# EAGLE design BR216_MKL_3075_21MTC_J2_010_01_07 (EAGLE 5.10)
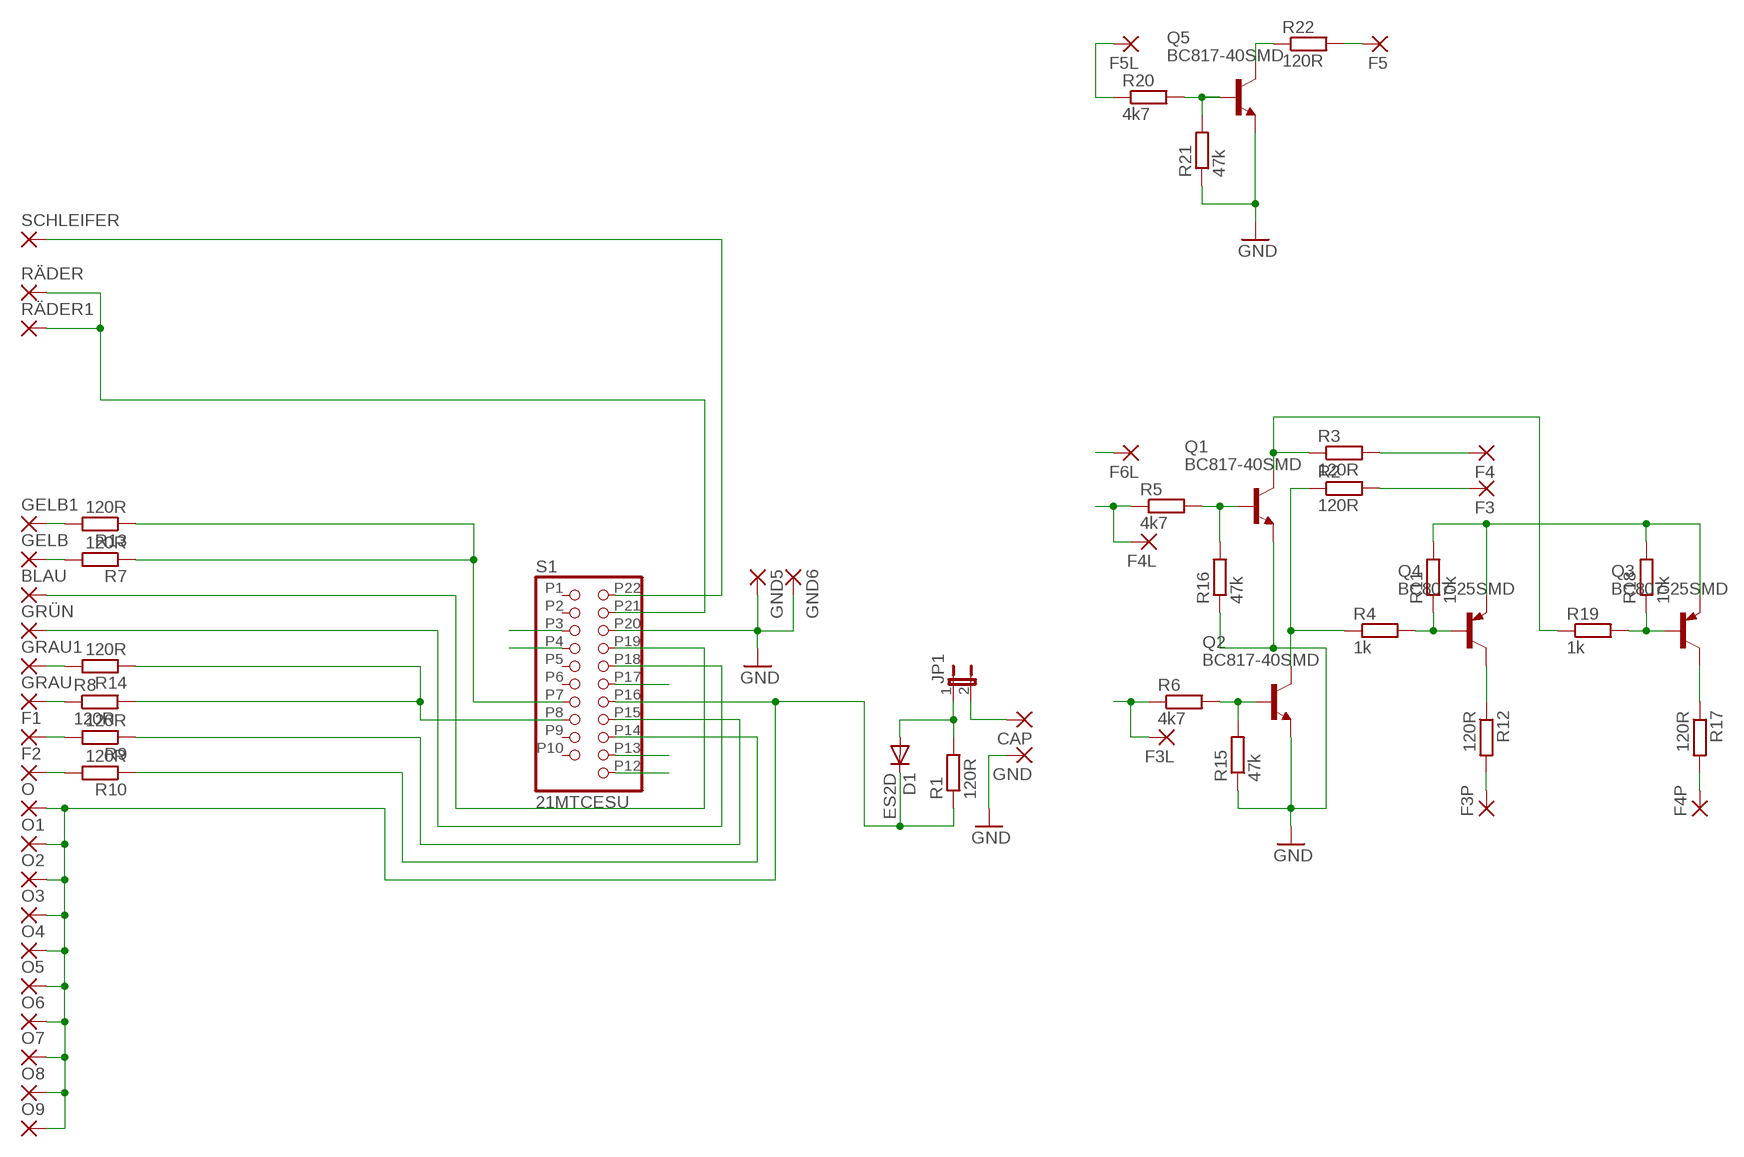
[diagram p0: schematic, sheet 1]

## Parts
BLAU  SMD2  [SMD1,27-2,54]
CAP  SMD2  [SMD1,27-2,54]
D1  ES2D  [SMB]
F1  SMD2  [SMD1,27-2,54]
F2  SMD2  [SMD1,27-2,54]
F3  SMD2  [SMD1,27-2,54]
F3L  SMD2  [SMD1,27-2,54]
F3P  SMD2  [SMD1,27-2,54]
F4  SMD2  [SMD1,27-2,54]
F4L  SMD2  [SMD1,27-2,54]
F4P  SMD2  [SMD1,27-2,54]
F5  SMD2  [SMD1,27-2,54]
F5L  SMD2  [SMD1,27-2,54]
F6L  SMD2  [SMD1,27-2,54]
GELB  SMD2  [SMD1,27-2,54]
GELB1  SMD2  [SMD1,27-2,54]
GND  SMD2  [SMD1,27-2,54]
GND5  SMD2  [SMD1,27-2,54]
GND6  SMD2  [SMD1,27-2,54]
GRAU  SMD2  [SMD1,27-2,54]
GRAU1  SMD2  [SMD1,27-2,54]
GRÜN  SMD2  [SMD1,27-2,54]
JP1  JP1E2,00  [JP1_2]
O  SMD2  [SMD1,27-2,54]
O1  SMD2  [SMD1,27-2,54]
O2  SMD2  [SMD1,27-2,54]
O3  SMD2  [SMD1,27-2,54]
O4  SMD2  [SMD1,27-2,54]
O5  SMD2  [SMD1,27-2,54]
O6  SMD2  [SMD1,27-2,54]
O7  SMD2  [SMD1,27-2,54]
O8  SMD2  [SMD1,27-2,54]
O9  SMD2  [SMD1,27-2,54]
Q1  BC817-40SMD  [SOT23-BEC]
Q2  BC817-40SMD  [SOT23-BEC]
Q3  BC807-25SMD  [SOT23-BEC]
Q4  BC807-25SMD  [SOT23-BEC]
Q5  BC817-40SMD  [SOT23-BEC]
R1  120R  R-EU_R0603S  [R0603S]
R2  120R  R-EU_R0603S  [R0603S]
R3  120R  R-EU_R0603S  [R0603S]
R4  1k  R-EU_R0603  [R0603]
R5  4k7  R-EU_R0603  [R0603]
R6  4k7  R-EU_R0603  [R0603]
R7  120R  R-EU_R0603S  [R0603S]
R8  120R  R-EU_R0603S  [R0603S]
R9  120R  R-EU_R0603S  [R0603S]
R10  120R  R-EU_R0603S  [R0603S]
R11  10k  R-EU_R0603  [R0603]
R12  120R  R-EU_R0603S  [R0603S]
R13  120R  R-EU_R0603S  [R0603S]
R14  120R  R-EU_R0603S  [R0603S]
R15  47k  R-EU_R0603  [R0603]
R16  47k  R-EU_R0603  [R0603]
R17  120R  R-EU_R0603S  [R0603S]
R18  10k  R-EU_R0603  [R0603]
R19  1k  R-EU_R0603  [R0603]
R20  4k7  R-EU_R0603  [R0603]
R21  47k  R-EU_R0603  [R0603]
R22  120R  R-EU_R0603S  [R0603S]
RÄDER  SMD2  [SMD1,27-2,54]
RÄDER1  SMD2  [SMD1,27-2,54]
S1  21MTCESU  [21MTC_SMD_ESU]
SCHLEIFER  SMD2  [SMD1,27-2,54]

## Nets
BLAU: BLAU.1(P) S1.P19
CAP: D1.A JP1.1 R1.2
F1: R9.1 S1.P15
F2: R10.1 S1.P14
F3: F3L.1(P) R6.1 S1.P13
F4: F4L.1(P) R5.1 S1.P4
F5: F5L.1(P) R20.1 S1.P17
F6: F6L.1(P) S1.P3
GELB: R7.1 R13.1 S1.P7
GND: GND5.1(P) GND6.1(P) GND.1(P) Q1.E Q2.E Q5.E R15.1 R16.1 R21.1 S1.P20
GRAU: R8.2 R14.1 S1.P8
GRÜN: GRÜN.1(P) S1.P18
N$1: CAP.1(P) JP1.2
N$2: F3.1(P) R2.2
N$3: F1.1(P) R9.2
N$4: F4.1(P) R3.2
N$5: Q2.C R2.1 R4.1
N$6: Q1.C R3.1 R19.1
N$7: Q1.B R5.2 R16.2
N$8: Q2.B R6.2 R15.2
N$9: GELB.1(P) R7.2
N$10: GRAU.1(P) R8.1
N$11: F2.1(P) R10.2
N$12: Q4.B R4.2 R11.1
N$13: F4P.1(P) R17.2
N$14: Q4.C R12.1
N$15: F3P.1(P) R12.2
N$16: GRAU1.1(P) R14.2
N$17: GELB1.1(P) R13.2
N$18: Q3.C R17.1
N$19: Q3.B R18.1 R19.2
N$20: Q5.B R20.2 R21.2
N$21: F5.1(P) R22.2
N$22: Q5.C R22.1
ORANGE: D1.C O1.1(P) O2.1(P) O3.1(P) O4.1(P) O5.1(P) O6.1(P) O7.1(P) O8.1(P) O9.1(P) O.1(P) Q3.E Q4.E R1.1 R11.2 R18.2 S1.P16
RÄDER: RÄDER1.1(P) RÄDER.1(P) S1.P21
SCHLEIFER: S1.P22 SCHLEIFER.1(P)
VCC: S1.P12
Unconnected: S1.P1 S1.P2 S1.P5 S1.P6 S1.P9 S1.P10

## Library data of the parts
BLAU CAP F1-F3 F3L F3P F4 F4L F4P F5 F5L F6L GELB GELB1 GND GND5 GND6 GRAU GRAU1 GRÜN O O1-O9 RÄDER RÄDER1 SCHLEIFER = wirepad:SMD2: SMD PAD
D1 = diode:ES2D: DIODE super fast rectifier, 2 A
JP1 = jumper:JP1E: JUMPER
Q1 Q2 Q5 = transistor-npn:BC817*: NPN Transistor
Q3 Q4 = transistor-pnp:BC807*: PNP Transistror
R1-R22 = rcl:R-EU_: RESISTOR, European symbol
S1 = pinhead:21MTC

## Board
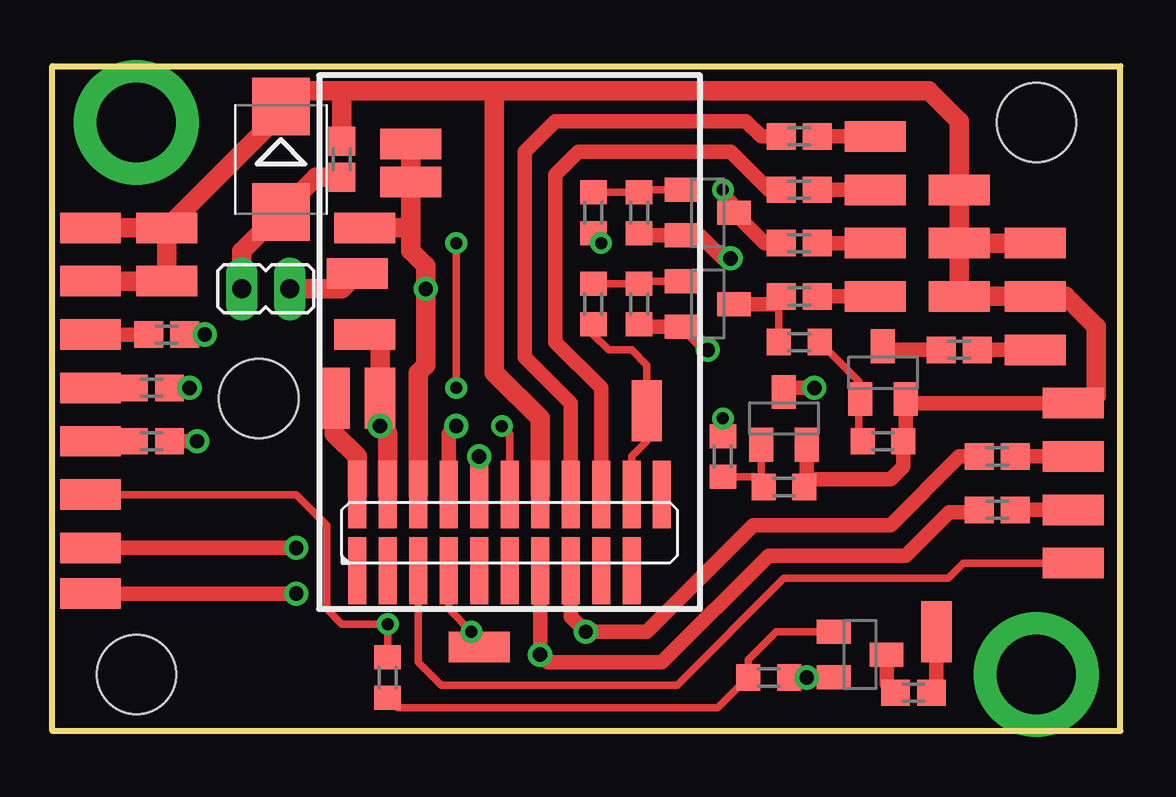
[diagram p1: board, top side]
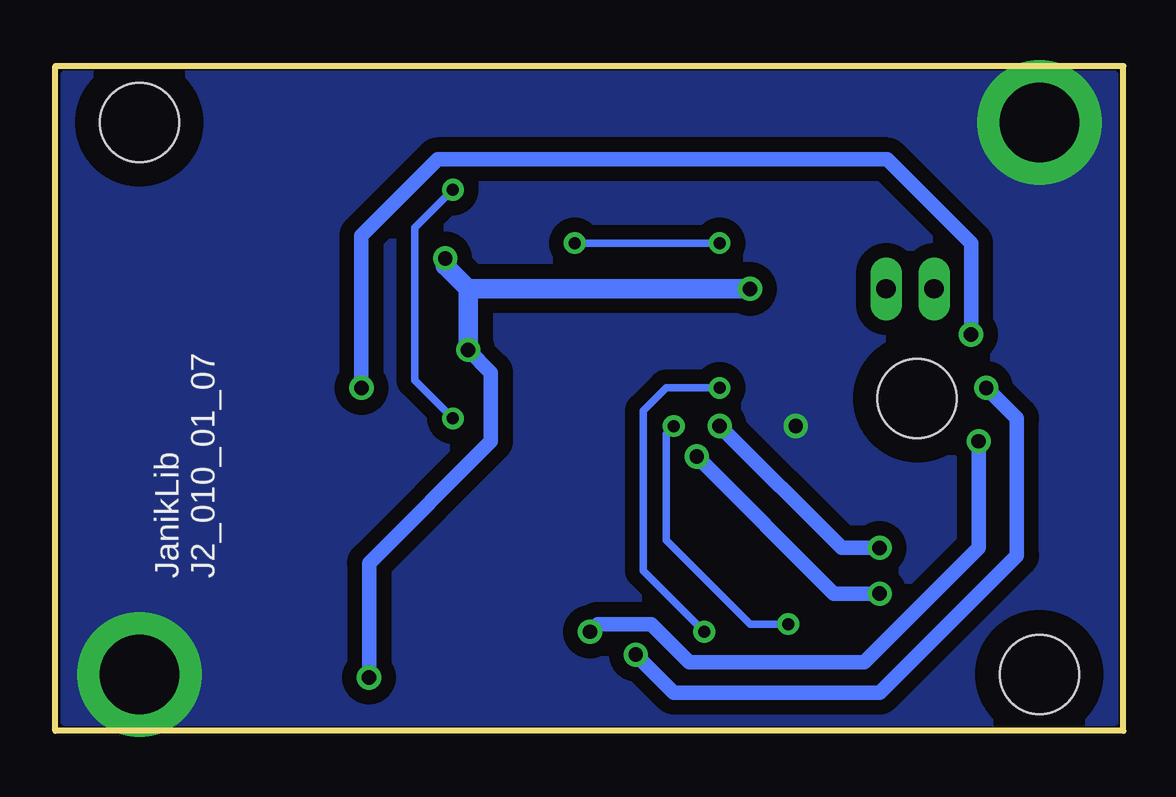
[diagram p2: board, bottom side, seen from below]

No outline drawn. Coordinates in mm, seen from the top.
Copper layers (1*16): Top 0.035mm / dielectric 1.5mm / Bottom 0.035mm
Design rules "default *": minimum track width 10mil, minimum drill 0.6mm, track to track 8mil, track to pad 8mil, pad to pad 8mil, via to via 8mil, smd to smd 8mil, copper to edge 40mil, drill to drill 8mil, minimum pad ring 10mil, minimum via ring 8mil, stop-mask expansion 4mil, vias tented up to drill 0mil, thermal gap 10mil
Holes 3.3 mm at 3.5,2.35 41,25.35 8.6,13.85
Milling: 4 lines

### Footprints (pad centres in the part's own frame; a part is rotated, then mirrored left to right if it is on the bottom)
SMD1,27-2,54 = smd 1.27 x 2.54: 1 0,0
SMB = smd 2.4 x 2.4: A 2.2,0; C -2.2,0
JP1_2 = drill 0.8 long: 1 0,-1; 2 0,1
SOT23-BEC = smd 1 x 1.4: B -0.95,-1.1; C 0,1.1; E 0.95,-1.1
R0603S = smd 1.2 x 1.1: 1 -0.75,0; 2 0.75,0
R0603 = smd 1 x 1.1: 1 -0.85,0; 2 0.85,0
21MTC_SMD_ESU = smd 0.75 x 2.8: P1 -6.35,-0.953; P2 -5.08,-0.953; P3 -3.81,-0.953; P4 -2.54,-0.953; P5 -1.27,-0.953; P6 0,-0.953; P7 1.27,-0.953; P8 2.54,-0.953; P9 3.81,-0.953; P10 5.08,-0.953; P12 6.35,2.223; P13 5.08,2.223; P14 3.81,2.223; P15 2.54,2.223; P16 1.27,2.223; P17 0,2.223; P18 -1.27,2.223; P19 -2.54,2.223; P20 -3.81,2.223; P21 -5.08,2.223; P22 -6.35,2.223

### Placement (x,y rotation side)
BLAU  1.59,7.62 90 top
CAP  12.7,19.05 270 top
D1  9.53,23.81 270 top
F1  34.29,24.77 270 top
F2  34.29,22.54 270 top
F3  34.29,18.1 270 top
F3L  24.77,13.34 180 top
F3P  40.96,15.88 270 top
F4  34.29,20.32 270 top
F4L  17.78,3.49 90 top
F4P  1.59,16.51 270 top
F5  36.83,4.13 0 top
F5L  1.59,9.84 270 top
F6L  42.55,6.99 90 top
GELB  1.59,14.29 270 top
GELB1  42.55,9.21 90 top
GND  13.02,20.95 270 top
GND5  14.92,22.86 90 top
GND6  14.92,24.45 90 top
GRAU  1.59,12.06 270 top
GRAU1  42.55,11.43 90 top
GRÜN  1.59,5.71 90 top
JP1  8.89,18.41 270 top
O  37.78,22.54 270 top
O1  1.59,18.73 270 top
O2  1.59,20.95 270 top
O3  37.78,20.32 270 top
O4  37.78,18.1 270 top
O5  40.96,20.32 270 top
O6  42.55,13.65 90 top
O7  4.76,18.73 90 top
O8  4.76,20.95 90 top
O9  40.96,18.1 90 top
Q1  27.3,21.59 270 top
Q2  27.3,17.78 270 top
Q3  30.48,13.02 0 top
Q4  34.61,14.92 0 top
Q5  33.66,3.17 270 top
R1  12.06,23.81 270 top
R2  31.11,18.1 0 top
R3  31.11,20.32 0 top
R4  31.11,16.19 0 top
R5  22.54,21.59 90 top
R6  22.54,17.78 90 top
R7  4.13,14.29 180 top
R8  4.13,12.06 0 top
R9  31.11,24.77 0 top
R10  31.11,22.54 0 top
R11  34.61,12.06 0 top
R12  37.78,15.88 0 top
R13  39.37,9.21 0 top
R14  39.37,11.43 0 top
R15  24.45,17.78 90 top
R16  24.45,21.59 90 top
R17  4.76,16.51 180 top
R18  30.48,10.16 0 top
R19  27.94,11.43 270 top
R20  13.97,2.22 270 top
R21  29.84,2.22 180 top
R22  35.88,1.59 0 top
RÄDER  13.02,16.51 90 top
RÄDER1  13.65,13.85 180 top
S1  19.05,7.62 0 top
SCHLEIFER  11.75,13.85 0 top

### Tracks (layer width: path | path; a pad name or v marks a point on that pad's centre or on a via)
BLAU  (via drill 0.6)
  Top 0.61: v16.83,12.7 16.51,12.38 S1.P19 | BLAU.1 v10.16,7.62
  Bottom 0.61: v16.83,12.7 11.75,7.62 v10.16,7.62
CAP
  Top 0.813: JP1.1 7.89,19.98 D1.A 10.97,23.06 R1.2
F1
  Top 0.61: S1.P15 21.59,13.65 19.68,15.56 19.68,24.13 20.95,25.4 28.89,25.4 29.53,24.77 R9.1
F2
  Top 0.61: S1.P14 22.86,14.29 20.95,16.19 20.95,23.18 21.91,24.13 28.26,24.13 29.84,22.54 R10.1
F3
  Top 0.305: R6.1 22.54,16.51 23.18,15.88 24.13,15.88 24.77,15.24 F3L.1 24.77,12.06 24.13,11.43 S1.P13
F4  (via drill 0.5)
  Top 0.305: 17.46,3.49 F4L.1 17.46,3.81 v17.46,4.13 16.51,5.08 S1.P4 | v16.83,14.29 v16.83,20.32 | R5.1 22.54,20.64 v22.86,20.32
  Bottom 0.305: v17.46,4.13 20,6.67 20,13.34 19.05,14.29 v16.83,14.29 | v16.83,20.32 v22.86,20.32
F5  (via drill 0.5)
  Top 0.305: S1.P17 19.05,12.38 v18.73,12.7 | R20.1 v13.97,4.45 12.06,4.45 11.43,5.08 11.43,8.57 10.16,9.84 F5L.1
  Bottom 0.305: v18.73,12.7 19.05,12.38 19.05,7.94 15.56,4.45 v13.97,4.45
F6
  Top 0.305: S1.P3 15.24,2.86 16.19,1.91 26.04,1.91 30.48,6.35 37.32,6.35 37.95,6.99 F6L.1 40.79,6.99
GELB  (via drill 0.6)
  Top 0.61: R13.1 38.52,9.11 37.37,9.11 35.56,7.3 29.84,7.3 25.4,2.86 20.64,2.86 v20.32,3.17 S1.P7 | v5.71,14.29 R7.1
  Bottom 0.61: v20.32,3.17 18.73,1.59 10.16,1.59 4.45,7.3 4.45,13.02 v5.71,14.29
GND  (via drill 0.6)
  Top 0.61: R16.1 24.55,20.64 Q1.E 26.99,20.64 27.94,19.68 v28.26,19.68 | R15.1 24.55,16.83 Q2.E 26.35,16.83 v27.3,15.88 | R21.1 v31.43,2.22 Q5.E
  Top 0.813: S1.P20 15.24,14.92 15.56,15.24 v15.56,18.41 15.56,19.37 14.92,20 14.92,20.95 | GND6.1 GND5.1 14.92,20.95 | 14.92,20.95 GND.1
  Bottom 0.61: v31.43,2.22 31.43,6.99 26.35,12.06 26.35,14.92 v27.3,15.88
  Bottom 0.813: v15.56,18.41 27.3,18.41 | v28.26,19.68 28.26,19.37 27.3,18.41 | 27.3,18.41 v27.3,15.88
GRAU  (via drill 0.6)
  Top 0.61: S1.P8 21.59,4.76 v22.23,4.13 24.77,4.13 29.21,8.57 34.92,8.57 37.78,11.43 R14.1 | R8.2 v6.03,12.06
  Bottom 0.61: v22.23,4.13 21.91,4.45 19.68,4.45 18.1,2.86 10.79,2.86 6.03,7.62 v6.03,12.06
GRÜN  (via drill 0.6)
  Top 0.61: v17.78,11.43 S1.P18 | GRÜN.1 v10.16,5.71
  Bottom 0.61: v17.78,11.43 12.06,5.71 v10.16,5.71
N$1
  Top 0.813: JP1.2 12.06,18.41 CAP.1
N$2
  Top 0.61: R2.2 F3.1
N$3
  Top 0.61: R9.2 F1.1
N$4
  Top 0.61: R3.2 F4.1
N$5
  Top 0.305: R4.1 30.27,18 R2.1
  Top 0.61: Q2.C 30.05,17.78 R2.1
N$6  (via drill 0.5)
  Top 0.305: Q1.C 28.41,22.08 v27.94,22.54 | R19.1 v27.94,13.02
  Top 0.61: Q1.C 29.68,20.32 R3.1
  Bottom 0.305: v27.94,22.54 29.53,20.95 29.53,14.61 v27.94,13.02
N$7
  Top 0.305: Q1.B 24.55,22.54 R16.2 R5.2
N$8
  Top 0.305: Q2.B 24.55,18.73 R15.2 R6.2
N$9
  Top 0.61: GELB.1 R7.2
N$10
  Top 0.61: GRAU.1 R8.1
N$11
  Top 0.61: R10.2 F2.1
N$12
  Top 0.305: 33.59,13.76 Q4.B | 33.59,13.76 33.59,12.23 R11.1 | 33.59,13.76 33.59,14.57 R4.2
N$13
  Top 0.61: F4P.1 R17.2
N$14
  Top 0.61: R12.1 34.76,15.88 Q4.C
N$15
  Top 0.61: R12.2 F3P.1
N$16
  Top 0.61: R14.2 GRAU1.1
N$17
  Top 0.61: R13.2 GELB1.1
N$18  (via drill 0.6)
  Top 0.61: R17.1 v6.35,16.51 | v31.75,14.29 30.65,14.29 Q3.C
  Bottom 0.61: v31.75,14.29 31.75,20.64 28.57,23.81 9.84,23.81 6.35,20.32 v6.35,16.51
N$19
  Top 0.305: 29.53,10.58 29.53,10.26 R18.1 | 29.53,10.58 R19.2 | Q3.B 29.53,10.58
N$20
  Top 0.305: R21.2 28.68,1.91 | R21.2 27.73,0.95 14.39,0.95 R20.2 | Q5.B 30.16,4.12 29,2.96 R21.2
N$21
  Top 0.61: R22.2 36.83,1.79 F5.1
N$22
  Top 0.61: Q5.C 34.76,1.96 R22.1
ORANGE
  Top 0.61: Q4.E 35.7,13.65 | O6.1 35.73,13.65 Q4.E | Q4.E 35.56,12.16 R11.2 35.46,11.01 34.92,10.48 31.43,10.48 | 31.43,10.48 Q3.E | 31.43,10.48 31.43,10.26 R18.2
  Top 0.813: O3.1 O4.1 O9.1 42.23,18.1 43.5,16.83 43.5,13.97 43.18,13.65 O6.1 | O3.1 O.1 37.78,25.4 36.51,26.67 18.41,26.67 | 12.06,26.67 10.18,26.67 D1.C 9.53,25.72 O8.1 | 18.41,26.67 13.97,26.67 12.06,26.67 | S1.P16 20.32,13.02 18.41,14.92 18.41,26.67 | O8.1 O2.1 | O8.1 O7.1 O1.1 | O3.1 O5.1 | 12.06,26.67 R1.1
RÄDER  (via drill 0.6, 3.3 pad 5.2)
  Top 0.813: S1.P21 13.97,12.38 v13.65,12.7 RÄDER1.1 13.65,16.51 RÄDER.1
  other vias: 3.5,25.35 41,2.35
  pour Bottom (isolate 0.61): 0.4,0.4 0.4,27.3 44.1,27.3 44.1,0.4
SCHLEIFER
  Top 0.813: S1.P22 12.7,11.43 11.75,12.38 SCHLEIFER.1

### Text on the board
bNames: J2_010_01_07 | JanikLib
bStop: design by Janik Merz | BR216 21MTC